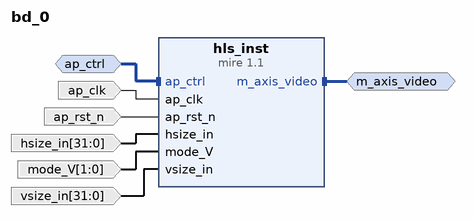
[diagram p0: block diagram of the top level]
# Vivado block design bd_0, xc7z020clg484-1, Vivado 2019.2
create_bd_design bd_0

create_bd_intf_port -mode Slave -vlnv xilinx.com:interface:acc_handshake_rtl:1.0 ap_ctrl
create_bd_intf_port -mode Master -vlnv xilinx.com:interface:axis_rtl:1.0 m_axis_video
set_property -dict {CONFIG.FREQ_HZ 100000000.0} [get_bd_intf_ports m_axis_video]
create_bd_port -dir I -type clk ap_clk
set_property -dict {CONFIG.FREQ_HZ 100000000.0} [get_bd_ports ap_clk]
create_bd_port -dir I -type rst ap_rst_n
create_bd_port -dir I -from 31 -to 0 -type data hsize_in
create_bd_port -dir I -from 1 -to 0 -type data mode_V
create_bd_port -dir I -from 31 -to 0 -type data vsize_in

create_bd_cell -type ip -vlnv xilinx.com:hls:mire:1.1 hls_inst

# ---- connections ----

connect_bd_intf_net -intf_net ap_ctrl_0_1 [get_bd_intf_ports ap_ctrl] [get_bd_intf_pins hls_inst/ap_ctrl]
connect_bd_intf_net [get_bd_intf_ports m_axis_video] [get_bd_intf_pins hls_inst/m_axis_video]
connect_bd_net -net ap_clk_0_1 [get_bd_ports ap_clk] [get_bd_pins hls_inst/ap_clk]
connect_bd_net -net ap_rst_n_0_1 [get_bd_ports ap_rst_n] [get_bd_pins hls_inst/ap_rst_n]
connect_bd_net -net hsize_in_0_1 [get_bd_ports hsize_in] [get_bd_pins hls_inst/hsize_in]
connect_bd_net -net mode_V_0_1 [get_bd_ports mode_V] [get_bd_pins hls_inst/mode_V]
connect_bd_net -net vsize_in_0_1 [get_bd_ports vsize_in] [get_bd_pins hls_inst/vsize_in]

validate_bd_design
save_bd_design
